# Altium schematic sheet 0_Architecture.SchDoc: OBDH Hardware Archictecture
size A4; DrawnBy: Sara V. Martinez; Engineer: Flight; Revision: V0.0; SheetNumber: 0; SheetTotal: 7
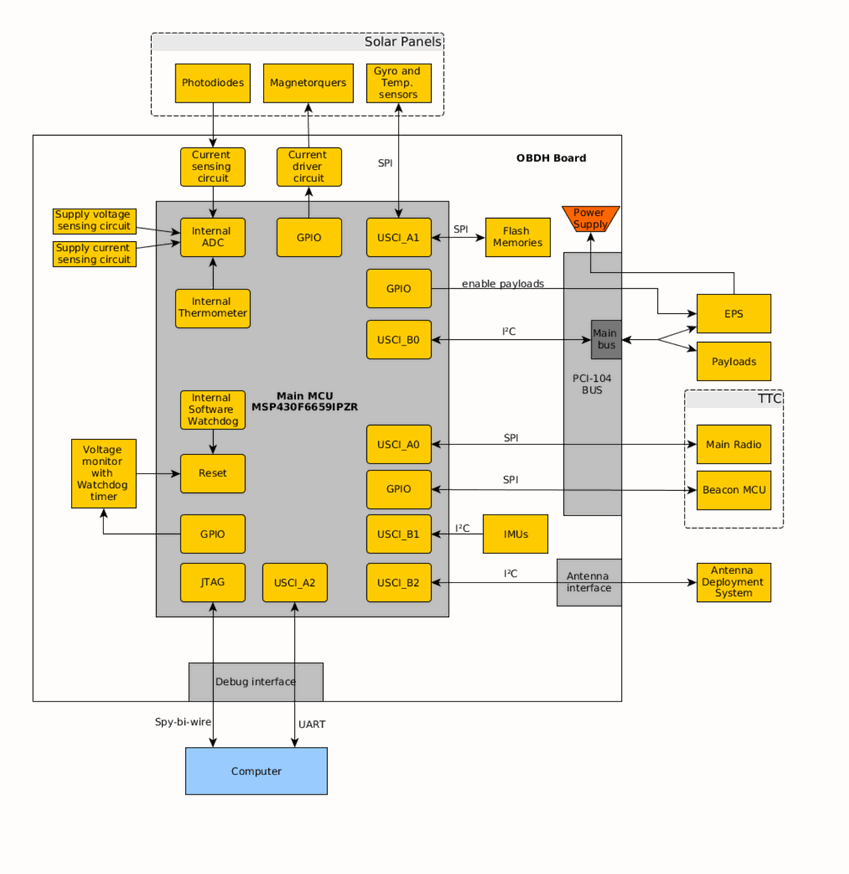
[diagram p0: 0_Architecture.SchDoc]

## Notes on the sheet
- Title
- Size:
- Date:
- A4
- Project:
- Time:
- FloripaSat
- Revision:
- Sheet
- of
- UFSC - SpaceLab
- University Campus - Trindade
- Dep. of Electrical Engineering - CTC
- Florianópolis, Santa Catarina, Brazil
- Drawn By:
- Model:
- CEP: 88040 - 900